# Altium schematic sheet heatersControl.SchDoc: Блок управления
size 420 x 297 mm; ApprovedBy: Мешков; CheckedBy: Черноскутов; Author: Самойлов; CompanyName: РГППУ; Title2str: нагревателями; DecimalNumber: АБВГ.123456.001 33
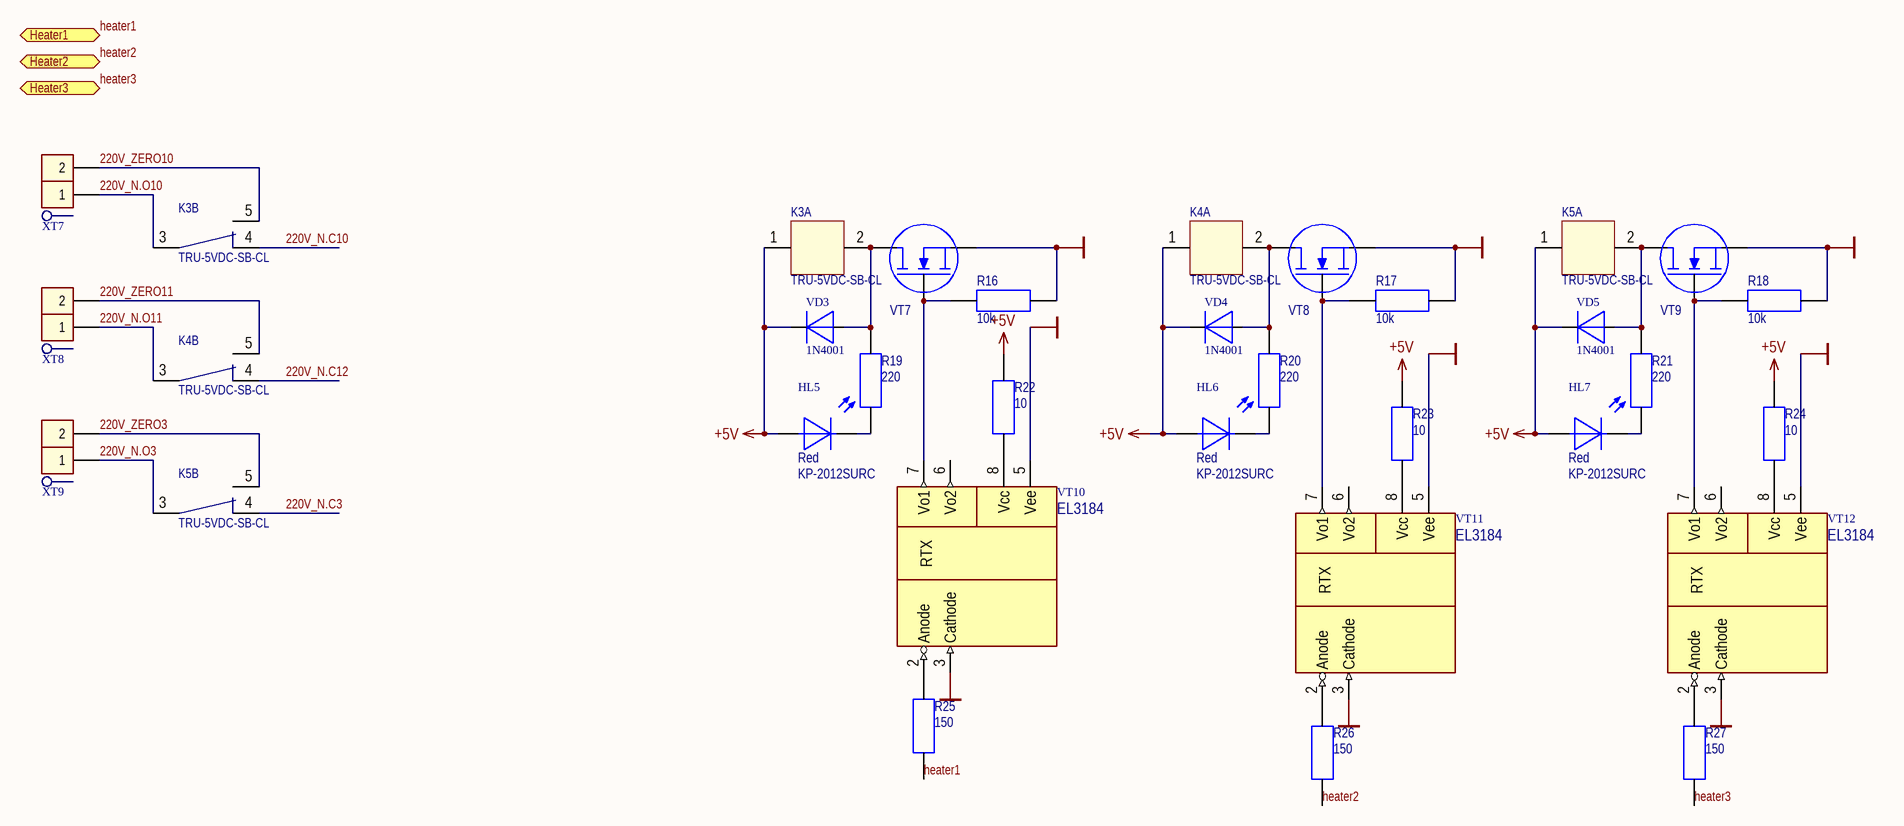
[diagram p0: heatersControl.SchDoc]

## Parts
HL5  Red  ManufacturerPartNumber: KP-2012SURC  [DIOMELF2012M]
HL6  Red  ManufacturerPartNumber: KP-2012SURC  [DIOMELF2012M]
HL7  Red  ManufacturerPartNumber: KP-2012SURC  [DIOMELF2012M]
K3  TRU-5VDC-SB-CL  [TRU-5VDC-SB-CL]  (parts A,B of 2)
K4  TRU-5VDC-SB-CL  [TRU-5VDC-SB-CL]  (parts A,B of 2)
K5  TRU-5VDC-SB-CL  [TRU-5VDC-SB-CL]  (parts A,B of 2)
R16  10k  [SMDRC0805]
R17  10k  [SMDRC0805]
R18  10k  [SMDRC0805]
R19  220  [SMDRC0805]
R20  220  [SMDRC0805]
R21  220  [SMDRC0805]
R22  10  [SMDRC0805]
R23  10  [SMDRC0805]
R24  10  [SMDRC0805]
R25  150  [SMDRC0805]
R26  150  [SMDRC0805]
R27  150  [SMDRC0805]
VD3  1N4001  [PinDiode]
VD4  1N4001  [PinDiode]
VD5  1N4001  [PinDiode]
VT7  2N7002  [SOT23 (TO-236AB)]  (value not drawn)
VT8  2N7002  [SOT23 (TO-236AB)]  (value not drawn)
VT9  2N7002  [SOT23 (TO-236AB)]  (value not drawn)
VT10  EL3184  [DIP8]
VT11  EL3184  [DIP8]
VT12  EL3184  [DIP8]
XT7  305-021-12  [330-021-12]  (value not drawn)
XT8  305-021-12  [330-021-12]  (value not drawn)
XT9  305-021-12  [330-021-12]  (value not drawn)

## Ports
Heater1 (in), Heater2 (in), Heater3 (in)

## Nets
+5V: HL5.1 HL6.1 HL7.1 K3.1 K4.1 K5.1 R22.2 R23.2 R24.2 VD3.K VD4.K VD5.K
GND: R16.2 R17.2 R18.2 VT7.2(S) VT8.2(S) VT9.2(S) VT10.3(Cathode) VT10.5(Vee) VT11.3(Cathode) VT11.5(Vee) VT12.3(Cathode) VT12.5(Vee)
220V_N.C3: K5.4
220V_N.C10: K3.4
220V_N.C12: K4.4
220V_N.O3: K5.3 XT9.1
220V_N.O10: K3.3 XT7.1
220V_N.O11: K4.3 XT8.1
220V_ZERO3: K5.5 XT9.2
220V_ZERO10: K3.5 XT7.2
220V_ZERO11: K4.5 XT8.2
heater1: R25.1 ; port Heater1
heater2: R26.1 ; port Heater2
heater3: R27.1 ; port Heater3
NetHL5_2: HL5.2 R19.2
NetHL6_2: HL6.2 R20.2
NetHL7_2: HL7.2 R21.2
NetK3_2: K3.2 R19.1 VD3.A VT7.3(D)
NetK4_2: K4.2 R20.1 VD4.A VT8.3(D)
NetK5_2: K5.2 R21.1 VD5.A VT9.3(D)
NetR16_1: R16.1 VT7.1(G) VT10.7(Vo1)
NetR17_1: R17.1 VT8.1(G) VT11.7(Vo1)
NetR18_1: R18.1 VT9.1(G) VT12.7(Vo1)
NetR22_1: R22.1 VT10.8(Vcc)
NetR23_1: R23.1 VT11.8(Vcc)
NetR24_1: R24.1 VT12.8(Vcc)
NetR25_2: R25.2 VT10.2(Anode)
NetR26_2: R26.2 VT11.2(Anode)
NetR27_2: R27.2 VT12.2(Anode)

Not connected (* = marked no-connect by the designer): VT10 6(Vo2); VT11 6(Vo2); VT12 6(Vo2)

## Notes on the sheet
- Изм.
- Лист
- N*докум.
- Подп.
- Дата
- Лит.
- Масса
- Масштаб
- Разраб.
- Пров.
- Т.контр.
- Лиcт
- Лиcтов
- Н.контр.
- Утв.
- (in symbol EL3184) RTX

## Library data of the parts
HL5-HL7 = LED1_R: Diod LED SMD Red; ComponentLink1Description: Datasheet; Cost: 5,01; ComponentLink2Description: Datasheet-local; ComponentLink2URL: *; Color: Red
R16-R18 = Resistor 0805 10k: Generic resistor; PartNumber: Resistor 0805 10k; Value: 10k; ComponentLink1URL: http://www.mouser.com/ds/2/447/PYu-RC0402_51_RoHS_L_6_r-8721.pdf; ComponentLink1Description: Datasheet; Package: 0805
R19-R21 = Resistor 0805 220: Generic resistor; PartNumber: Resistor 0805 220; Value: 220; ComponentLink1URL: http://www.mouser.com/ds/2/447/PYu-RC0402_51_RoHS_L_6_r-8721.pdf; ComponentLink1Description: Datasheet; Package: 0805
R22-R24 = Resistor 0805 10: Generic resistor; PartNumber: Resistor 0805 10; Value: 10; ComponentLink1URL: http://www.mouser.com/ds/2/447/PYu-RC0402_51_RoHS_L_6_r-8721.pdf; ComponentLink1Description: Datasheet; Package: 0805
R25-R27 = Resistor 0805 150: Generic resistor; PartNumber: Resistor 0805 150; Value: 150; ComponentLink1URL: http://www.mouser.com/ds/2/447/PYu-RC0402_51_RoHS_L_6_r-8721.pdf; ComponentLink1Description: Datasheet; Package: 0805
VD3-VD5 = 1N4001: Rectifying diode; ComponentLink1Description: Datasheet; ComponentLink1URL: http://www.promelec.ru/pdf/1N400x.pdf; Cost: 5; Package: штырьевой; ComponentLink2Description: Datasheet-local; ComponentLink2URL: *; ManufacturerPartNumber: 1N4001
VT7-VT9 = 2N7002 n-MOSFET: 60V, 300mA N-channel Trench MOSFET; ManufacturerPartNumber: 2N7002
VT10-VT12 = EL3184: Optocouple IGBT driver; Manufacturer: Everlight Electronics Co. Ltd; Package: DIP-8; ComponentLink1URL: http://www.promelec.ru/pdf/EL3184-EVLT.pdf; ComponentLink1Description: Datasheet; Cost: 66,38; Supplier: Промэлектроника; ManufacturerPartNumber: EL3184
XT7-XT9 = Con2_D 305-021-12: Demountable connection  2-pin; Manufacturer: Degson Electronics Co., Ltd; ManufacturerPartNumber: 305-021-12; ComponentLink1Description: Datasheet; Cost: 7,45; Supplier: Промэлектроника; ComponentLink2Description: Datasheet-local
K3-K5 = TRU-5VDC-SB-CL: ManufacturerPurtNumber: TRU-5VDC-SB-CL